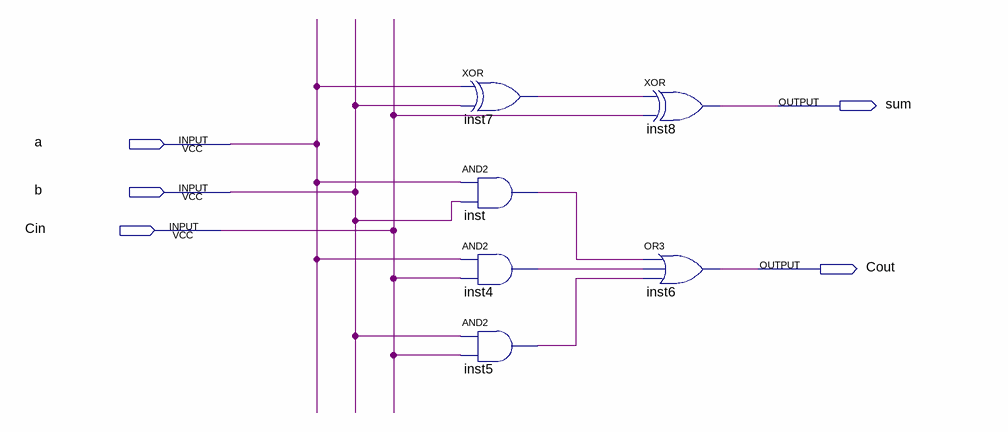
[diagram p0: schematic sheet]
// Quartus schematic FA.bdf as structural Verilog: 6 symbols, 5 pins
module FA (
  input  a,
  input  b,
  input  Cin,
  output sum,
  output Cout
);

  wire inst4_out, inst5_out, inst7_out, inst_out;

  xor inst7 (inst7_out, a, b);
  and inst (inst_out, a, b);
  and inst4 (inst4_out, a, Cin);
  and inst5 (inst5_out, b, Cin);
  xor inst8 (sum, inst7_out, Cin);
  or inst6 (Cout, inst_out, inst4_out, inst5_out);
endmodule
